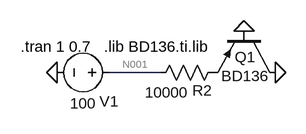
[diagram p0: schematic beta_measuring.asc]
beta_measuring.asc, the LTspice schematic file:
Version 4
SHEET 1 880 680
WIRE 304 288 224 288
FLAG 144 288 0
FLAG 432 224 0
FLAG 480 288 0
SYMBOL pnp 480 224 R90
WINDOW 0 40 30 VRight 2
WINDOW 3 69 9 VRight 2
SYMATTR InstName Q1
SYMATTR Value BD136
SYMBOL voltage 240 288 R90
WINDOW 0 60 16 VBottom 2
WINDOW 3 32 56 VTop 2
WINDOW 123 0 0 Left 0
WINDOW 39 0 0 Left 0
SYMATTR InstName V1
SYMATTR Value 100
SYMBOL res 288 304 R270
WINDOW 0 -27 80 VTop 2
WINDOW 3 1 25 VBottom 2
SYMATTR InstName R2
SYMATTR Value 10000
TEXT 216 248 Left 2 !.lib BD136.ti.lib
TEXT 88 248 Left 2 !.tran 1 0.7

The netlist it stands for:
* beta_measuring.asc
Q1 0 0 P001 0 BD136
V1 N001 0 100
R2 N001 P001 10000
.model NPN NPN
.model PNP PNP
.lib standard.bjt
.lib BD136.ti.lib
.tran 1 0.7
.backanno
.end

* Results of the author's LTspice run, read from the files saved beside the schematic
* Operating Point, zero values left out:
*   V(p001) = 662.7 mV
*   V(n001) = 100 V
*   Ic(Q1) = -9.888 mA
*   Ib(Q1) = -45.54 µA
*   Ie(Q1) = 9.934 mA
*   I(R2) = 9.934 mA
*   I(V1) = -9.934 mA